# EAGLE design AutoPilot (EAGLE 6.4)
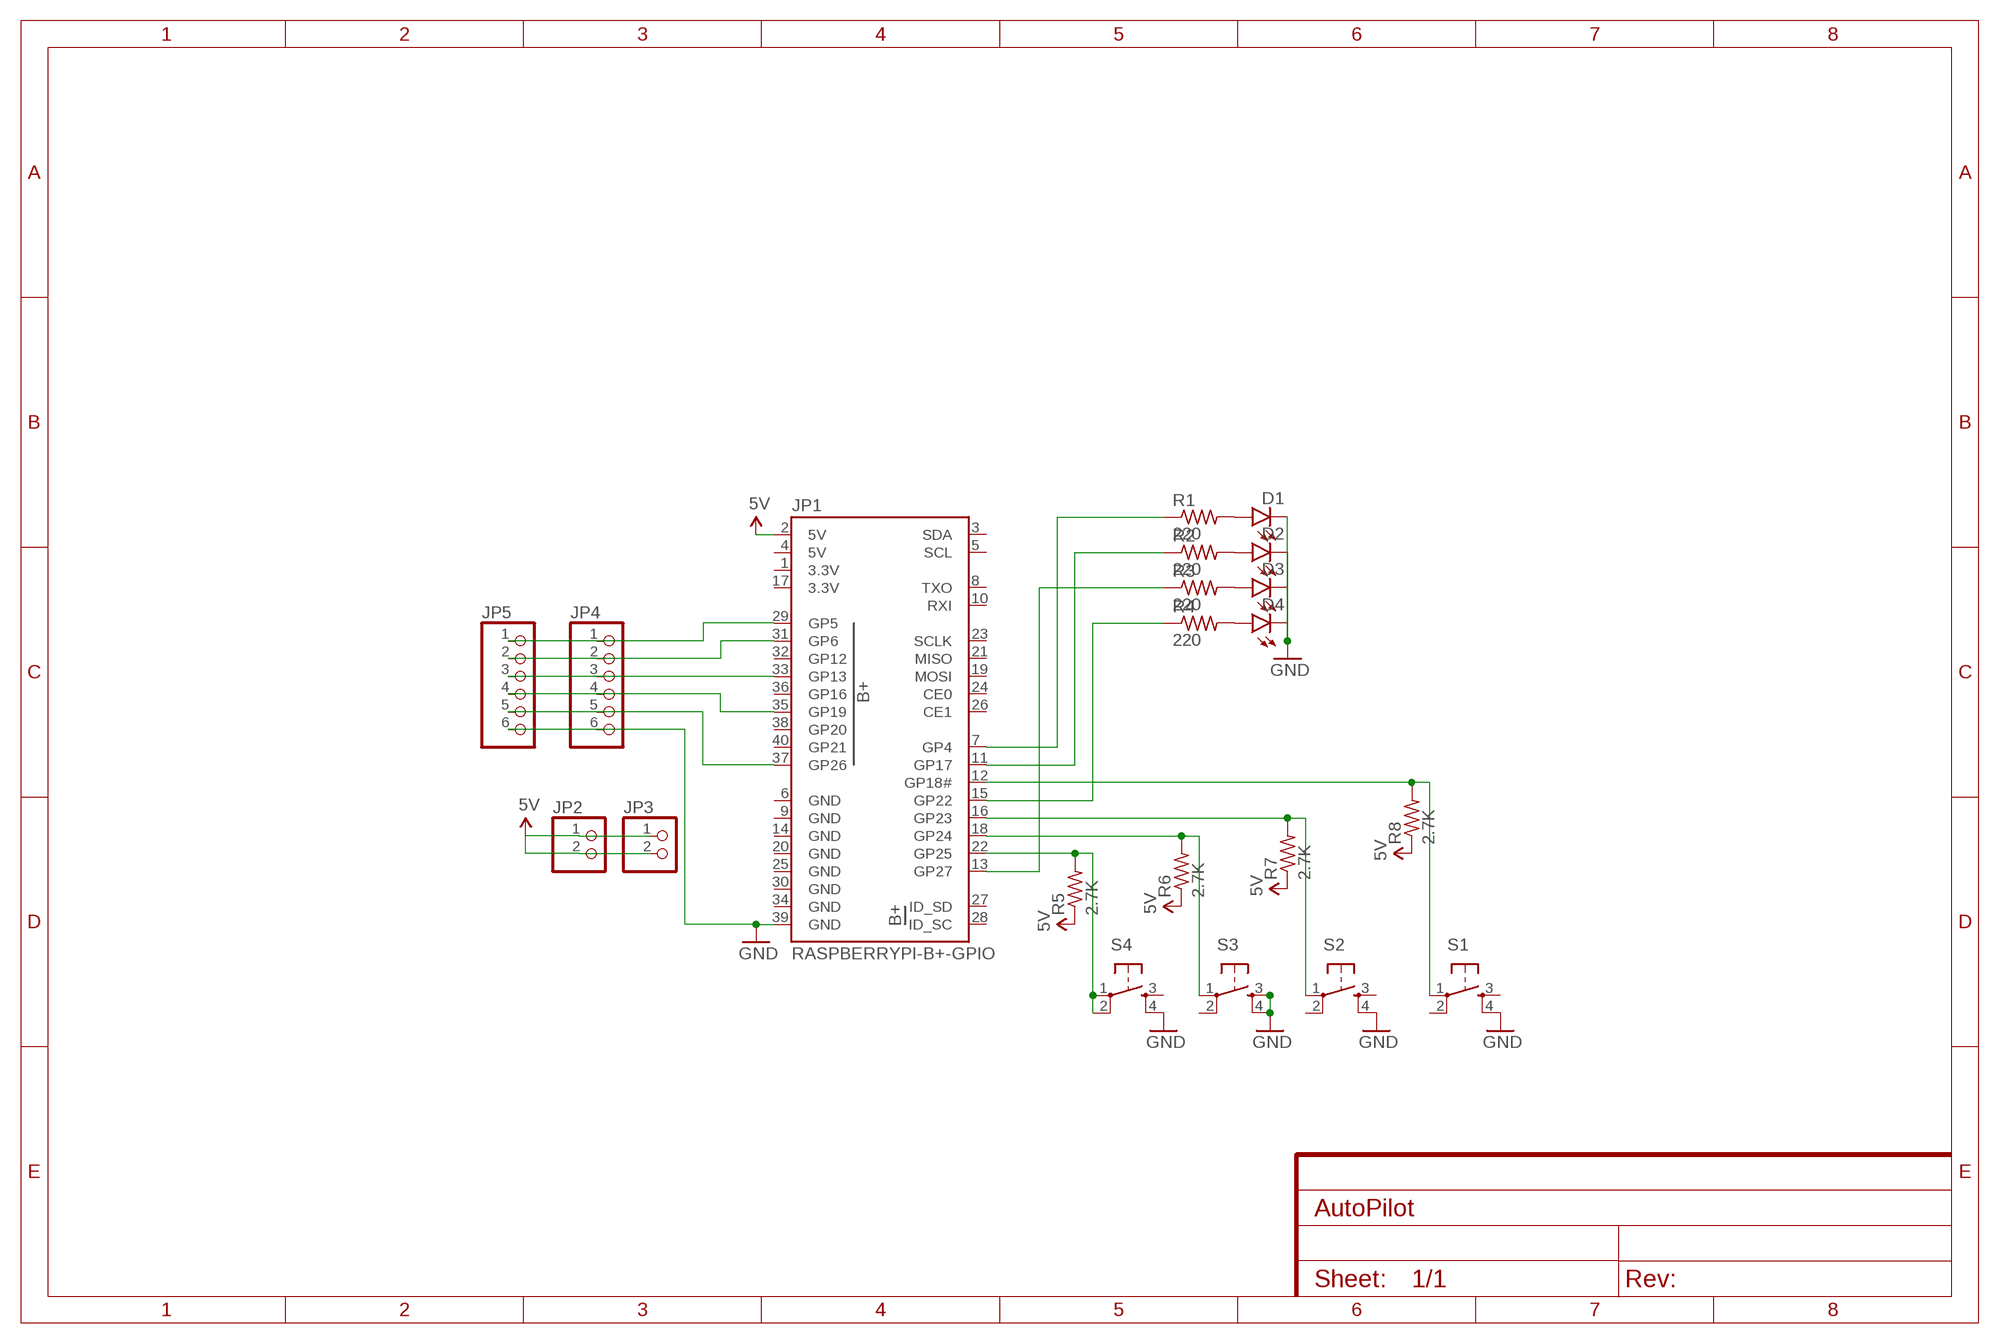
[diagram p0: schematic, sheet 1]

## Parts
D1  LED5MM  [LED5MM]
D2  LED5MM  [LED5MM]
D3  LED5MM  [LED5MM]
D4  LED5MM  [LED5MM]
JP1  RASPBERRYPI-B+-GPIO  [2X20-SHROUDED]
JP2  PINHD-1X2  [1X02]
JP3  PINHD-1X2  [1X02]
JP4  PINHD-1X6  [1X06]
JP5  PINHD-1X6  [1X06]
R1  220  R-US_0204/2V  [0204V]
R2  220  R-US_0204/2V  [0204V]
R3  220  R-US_0204/2V  [0204V]
R4  220  R-US_0204/2V  [0204V]
R5  2.7K  R-US_0204/2V  [0204V]
R6  2.7K  R-US_0204/2V  [0204V]
R7  2.7K  R-US_0204/2V  [0204V]
R8  2.7K  R-US_0204/2V  [0204V]
S1  TAC_SWITCHPTH  [TACTILE-PTH]
S2  TAC_SWITCHPTH  [TACTILE-PTH]
S3  TAC_SWITCHPTH  [TACTILE-PTH]
S4  TAC_SWITCHPTH  [TACTILE-PTH]

## Nets
5V: JP1.2(5V) JP2.1 JP2.2 JP3.1 JP3.2 R5.1 R6.1 R7.1 R8.1
GND: D1.K(C) D2.K(C) D3.K(C) D4.K(C) JP1.39(GND) JP4.6 JP5.6 S1.4 S2.4 S3.3 S3.4 S4.4
N$1: JP1.12(GP18#) R8.2 S1.1
N$2: JP1.7(GP4) R1.1
N$3: JP1.18(GP24) R6.2 S3.1
N$4: JP1.22(GP25) R5.2 S4.1 S4.2
N$5: JP1.29(GP5) JP4.1 JP5.1
N$6: JP1.31(GP6) JP4.2 JP5.2
N$7: D2.A R2.2
N$8: D3.A R3.2
N$9: D1.A R1.2
N$10: D4.A R4.2
N$11: JP1.16(GP23) R7.2 S2.1
N$12: JP1.11(GP17) R2.1
N$13: JP1.15(GP22) R4.1
N$14: JP1.13(GP27) R3.1
N$15: JP1.33(GP13) JP4.3 JP5.3
N$16: JP1.35(GP19) JP4.4 JP5.4
N$17: JP1.37(GP26) JP4.5 JP5.5
Unconnected: JP1.3(SDA) JP1.5(SCL) JP1.8(TXO) JP1.10(RXI) JP1.19(MOSI) JP1.21(MISO) JP1.23(SCLK) JP1.24(CE0) JP1.26(CE1) JP1.27(ID_SD) JP1.28(ID_SC) JP1.32(GP12) JP1.36(GP16) JP1.38(GP20) JP1.40(GP21) S1.2 S1.3 S2.2 S2.3 S3.2 S4.3

## Power pins joined to a net without a drawn wire
3.3V: JP1.1(3.3V) JP1.17(3.3V)
5V: JP1.4(5V)
GND: JP1.6(GND) JP1.9(GND) JP1.14(GND) JP1.20(GND) JP1.25(GND) JP1.30(GND) JP1.34(GND)

## Library data of the parts
D1-D4 = SparkFun-LED:LED: LEDs Standard schematic elements and footprints for 5mm, 3mm, 1206, and 0603 sized LEDs. 5mm - Spark Fun Electronics SKU : COM-00529 (and others)
JP1 = SparkFun-Boards:RASPBERRYPI-B+-GPIO: Raspberry Pi B+ GPIO Header 2x20 pin connector
JP2 JP3 = pinhead:PINHD-1X2: PIN HEADER
JP4 JP5 = pinhead:PINHD-1X6: PIN HEADER
R1-R8 = resistor:R-US_: RESISTOR, American symbol
S1-S4 = SparkFun-Retired:TAC_SWITCH: Momentary Switch Button commonly used for reset or general input. Spark Fun Electronics SKU : COM-00097 SMT- SWCH-08247

## Board
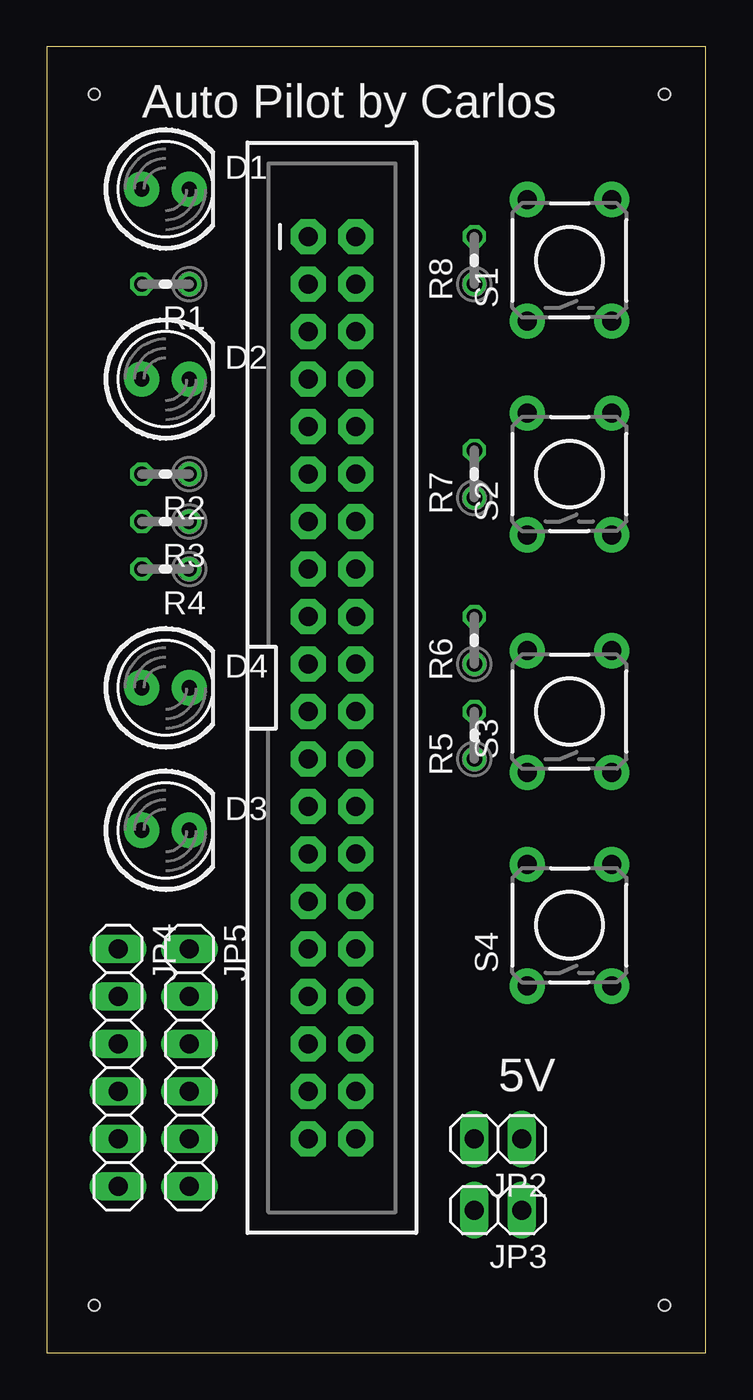
[diagram p1: board, top side]
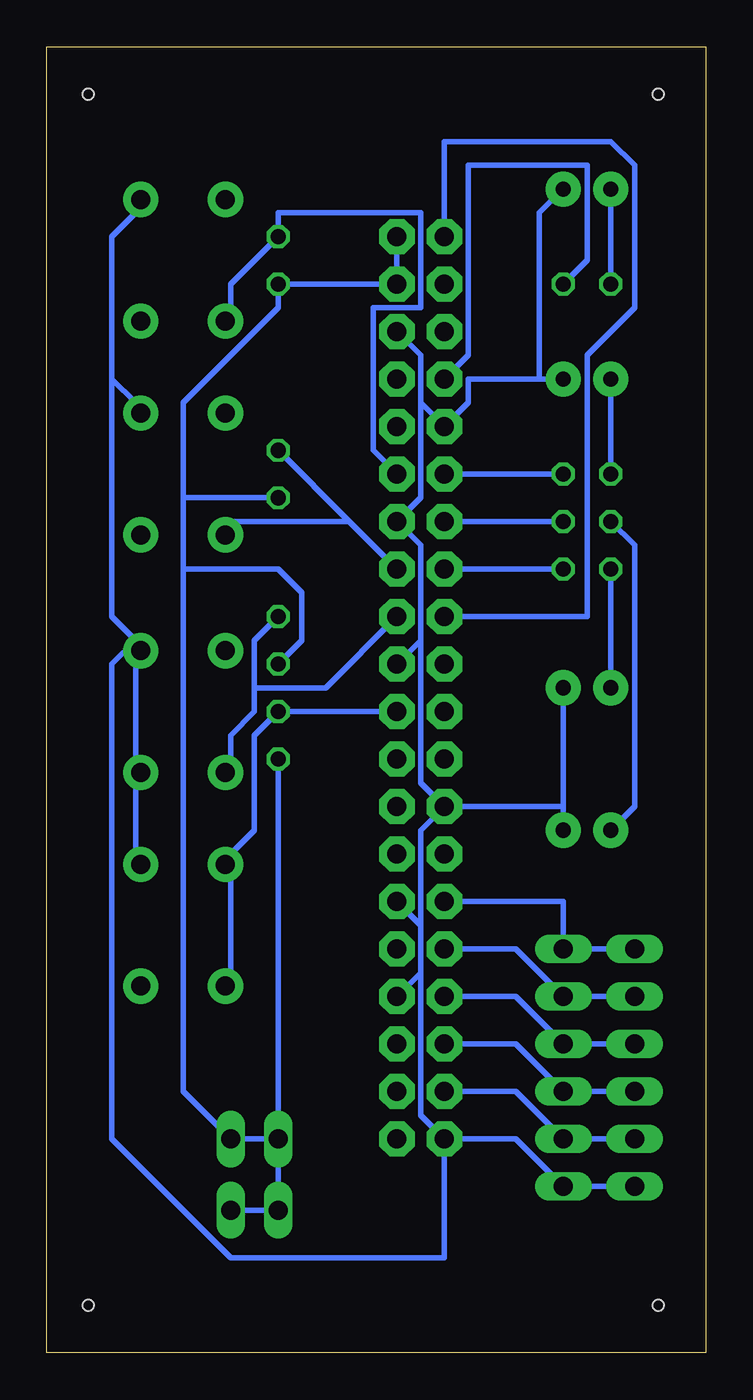
[diagram p2: board, bottom side, seen from below]

Size 35.23 x 69.84 mm. Coordinates in mm from the lower left corner, seen from the top.
Outline: 0,0 35.23,0 35.23,69.84 0,69.84 0,0
Copper layers (1*16): Top 0.0356mm / dielectric 1.5011mm / Bottom 0.0356mm
Design rules "LaenPCBOrder *": minimum track width 12mil, minimum drill 13mil, track to track 6mil, track to pad 6mil, pad to pad 6mil, via to via 6mil, smd to smd 6mil, copper to edge 15mil, drill to drill 6mil, minimum pad ring 7mil, minimum via ring 7mil, stop-mask expansion 3mil, vias tented up to drill 0mil, thermal gap 10mil
Holes 0.6 mm at 2.54,2.54 33.02,2.54 33.02,67.31 2.54,67.31

### Footprints (pad centres in the part's own frame; a part is rotated, then mirrored left to right if it is on the bottom)
LED5MM = drill 0.813 pad 1.88: A -1.27,0; K 1.27,0
2X20-SHROUDED = drill 1.016 pad 1.88 octagon: 1 -1.27,24.13; 2 1.27,24.13; 3 -1.27,21.59; 4 1.27,21.59; 5 -1.27,19.05; 6 1.27,19.05; 7 -1.27,16.51; 8 1.27,16.51; 9 -1.27,13.97; 10 1.27,13.97; 11 -1.27,11.43; 12 1.27,11.43; 13 -1.27,8.89; 14 1.27,8.89; 15 -1.27,6.35; 16 1.27,6.35; 17 -1.27,3.81; 18 1.27,3.81; 19 -1.27,1.27; 20 1.27,1.27; 21 -1.27,-1.27; 22 1.27,-1.27; 23 -1.27,-3.81; 24 1.27,-3.81; 25 -1.27,-6.35; 26 1.27,-6.35; 27 -1.27,-8.89; 28 1.27,-8.89; 29 -1.27,-11.43; 30 1.27,-11.43; 31 -1.27,-13.97; 32 1.27,-13.97; 33 -1.27,-16.51; 34 1.27,-16.51; 35 -1.27,-19.05; 36 1.27,-19.05; 37 -1.27,-21.59; 38 1.27,-21.59; 39 -1.27,-24.13; 40 1.27,-24.13
1X02 = drill 1.016 long: 1 -1.27,0; 2 1.27,0
1X06 = drill 1.016 long: 1 -6.35,0; 2 -3.81,0; 3 -1.27,0; 4 1.27,0; 5 3.81,0; 6 6.35,0
0204V = drill 0.813 octagon: 1 -1.27,0; 2 1.27,0
TACTILE-PTH = drill 1.016 pad 1.88: 1 -3.251,2.261; 2 3.251,2.261; 3 -3.251,-2.261; 4 3.251,-2.261

### Placement (x,y rotation side)
D1  6.35,62.23 0 top
D2  6.35,52.07 0 top
D3  6.35,27.94 0 top
D4  6.35,35.56 0 top
JP1  15.24,35.56 0 top
JP2  24.13,11.43 180 top
JP3  24.13,7.62 180 top
JP4  3.81,15.24 270 top
JP5  7.62,15.24 270 top
R1  6.35,57.15 180 top
R2  6.35,46.99 180 top
R3  6.35,44.45 180 top
R4  6.35,41.91 180 top
R5  22.86,33.02 90 top
R6  22.86,38.1 90 top
R7  22.86,46.99 90 top
R8  22.86,58.42 90 top
S1  27.94,58.42 90 top
S2  27.94,46.99 90 top
S3  27.94,34.29 90 top
S4  27.94,22.86 90 top

### Tracks (layer width: path | path; a pad name or v marks a point on that pad's centre or on a via)
3.3V
  Bottom 0.305: JP1.17 6.35,39.37 6.35,53.34 3.81,55.88 3.81,63.5 5.08,64.77 13.97,64.77 JP1.1
5V
  Bottom 0.305: JP3.1 JP3.2 JP2.2 | JP2.2 JP2.1 27.94,13.97 27.94,41.91 | JP1.2 JP1.4 R8.1 22.86,55.88 27.94,50.8 27.94,45.72 | JP2.2 R5.1 | R6.1 21.59,38.1 21.59,40.64 22.86,41.91 27.94,41.91 | 27.94,45.72 27.94,41.91 | 27.94,45.72 R7.1
GND
  Bottom 0.305: JP4.6 JP5.6 10.16,11.43 JP1.39 | D4.K 7.62,29.21 | 7.62,29.21 D3.K | 7.62,29.21 JP1.25 | 15.24,20.32 JP1.34 | 15.24,22.86 15.24,20.32 | JP1.30 15.24,22.86 | JP1.39 15.24,12.7 15.24,20.32 | JP1.25 15.24,27.94 15.24,22.86 | 15.24,38.1 JP1.20 | 15.24,38.1 15.24,43.18 JP1.14 15.24,45.72 15.24,50.8 | 8.89,52.07 12.7,52.07 12.7,50.8 JP1.9 15.24,50.8 | 8.89,52.07 D2.K | JP1.6 15.24,53.34 15.24,50.8 | D1.K 8.89,60.96 8.89,52.07 | JP1.25 15.24,30.48 15.24,38.1 | S4.4 30.48,26.67 30.48,30.48 S3.3 30.48,31.75 30.48,36.83 S3.4 30.48,38.1 | 31.75,52.07 30.48,50.8 S2.4 | 31.75,52.07 31.75,59.69 30.48,60.96 S1.4 | 30.48,38.1 31.75,39.37 31.75,52.07 | 30.48,38.1 31.75,36.83 31.75,11.43 25.4,5.08 13.97,5.08 JP1.39
N$1
  Bottom 0.305: S1.1 25.4,55.88 25.4,57.15 R8.2 22.86,60.96 15.24,60.96 15.24,55.88 17.78,55.88 17.78,48.26 JP1.12
N$2
  Bottom 0.305: R1.1 6.35,58.42 6.35,63.5 12.7,63.5 12.7,53.34 JP1.7
N$3
  Bottom 0.305: R6.2 24.13,38.1 24.13,35.56 | 24.13,35.56 24.13,34.29 25.4,33.02 25.4,31.75 S3.1 | JP1.18 20.32,35.56 24.13,35.56
N$4
  Bottom 0.305: JP1.22 R5.2 24.13,33.02 24.13,27.94 25.4,26.67 S4.2 25.4,25.4 25.4,20.32 S4.1
N$5
  Bottom 0.305: JP4.1 JP5.1 7.62,24.13 JP1.29
N$6
  Bottom 0.305: JP4.2 JP5.2 10.16,21.59 JP1.31
N$7
  Bottom 0.305: D2.A R2.2
N$8
  Bottom 0.305: R3.2 3.81,43.18 3.81,29.21 D3.A
N$9
  Bottom 0.305: D1.A R1.2
N$10
  Bottom 0.305: D4.A R4.2
N$11
  Bottom 0.305: JP1.16 19.05,44.45 | 19.05,44.45 R7.2 | 19.05,44.45 25.4,44.45 S2.1
N$12
  Bottom 0.305: JP1.11 R2.1
N$13
  Bottom 0.305: JP1.15 R4.1
N$14
  Bottom 0.305: JP1.13 R3.1
N$15
  Bottom 0.305: JP4.3 JP5.3 10.16,19.05 JP1.33
N$16
  Bottom 0.305: JP4.4 JP5.4 10.16,16.51 JP1.35
N$17
  Bottom 0.305: JP4.5 JP5.5 10.16,13.97 JP1.37

### Text on the board
tNames: Auto Pilot by Carlos | 5V